# EAGLE design MySens-easyESP32-011 (EAGLE 7.7.0)
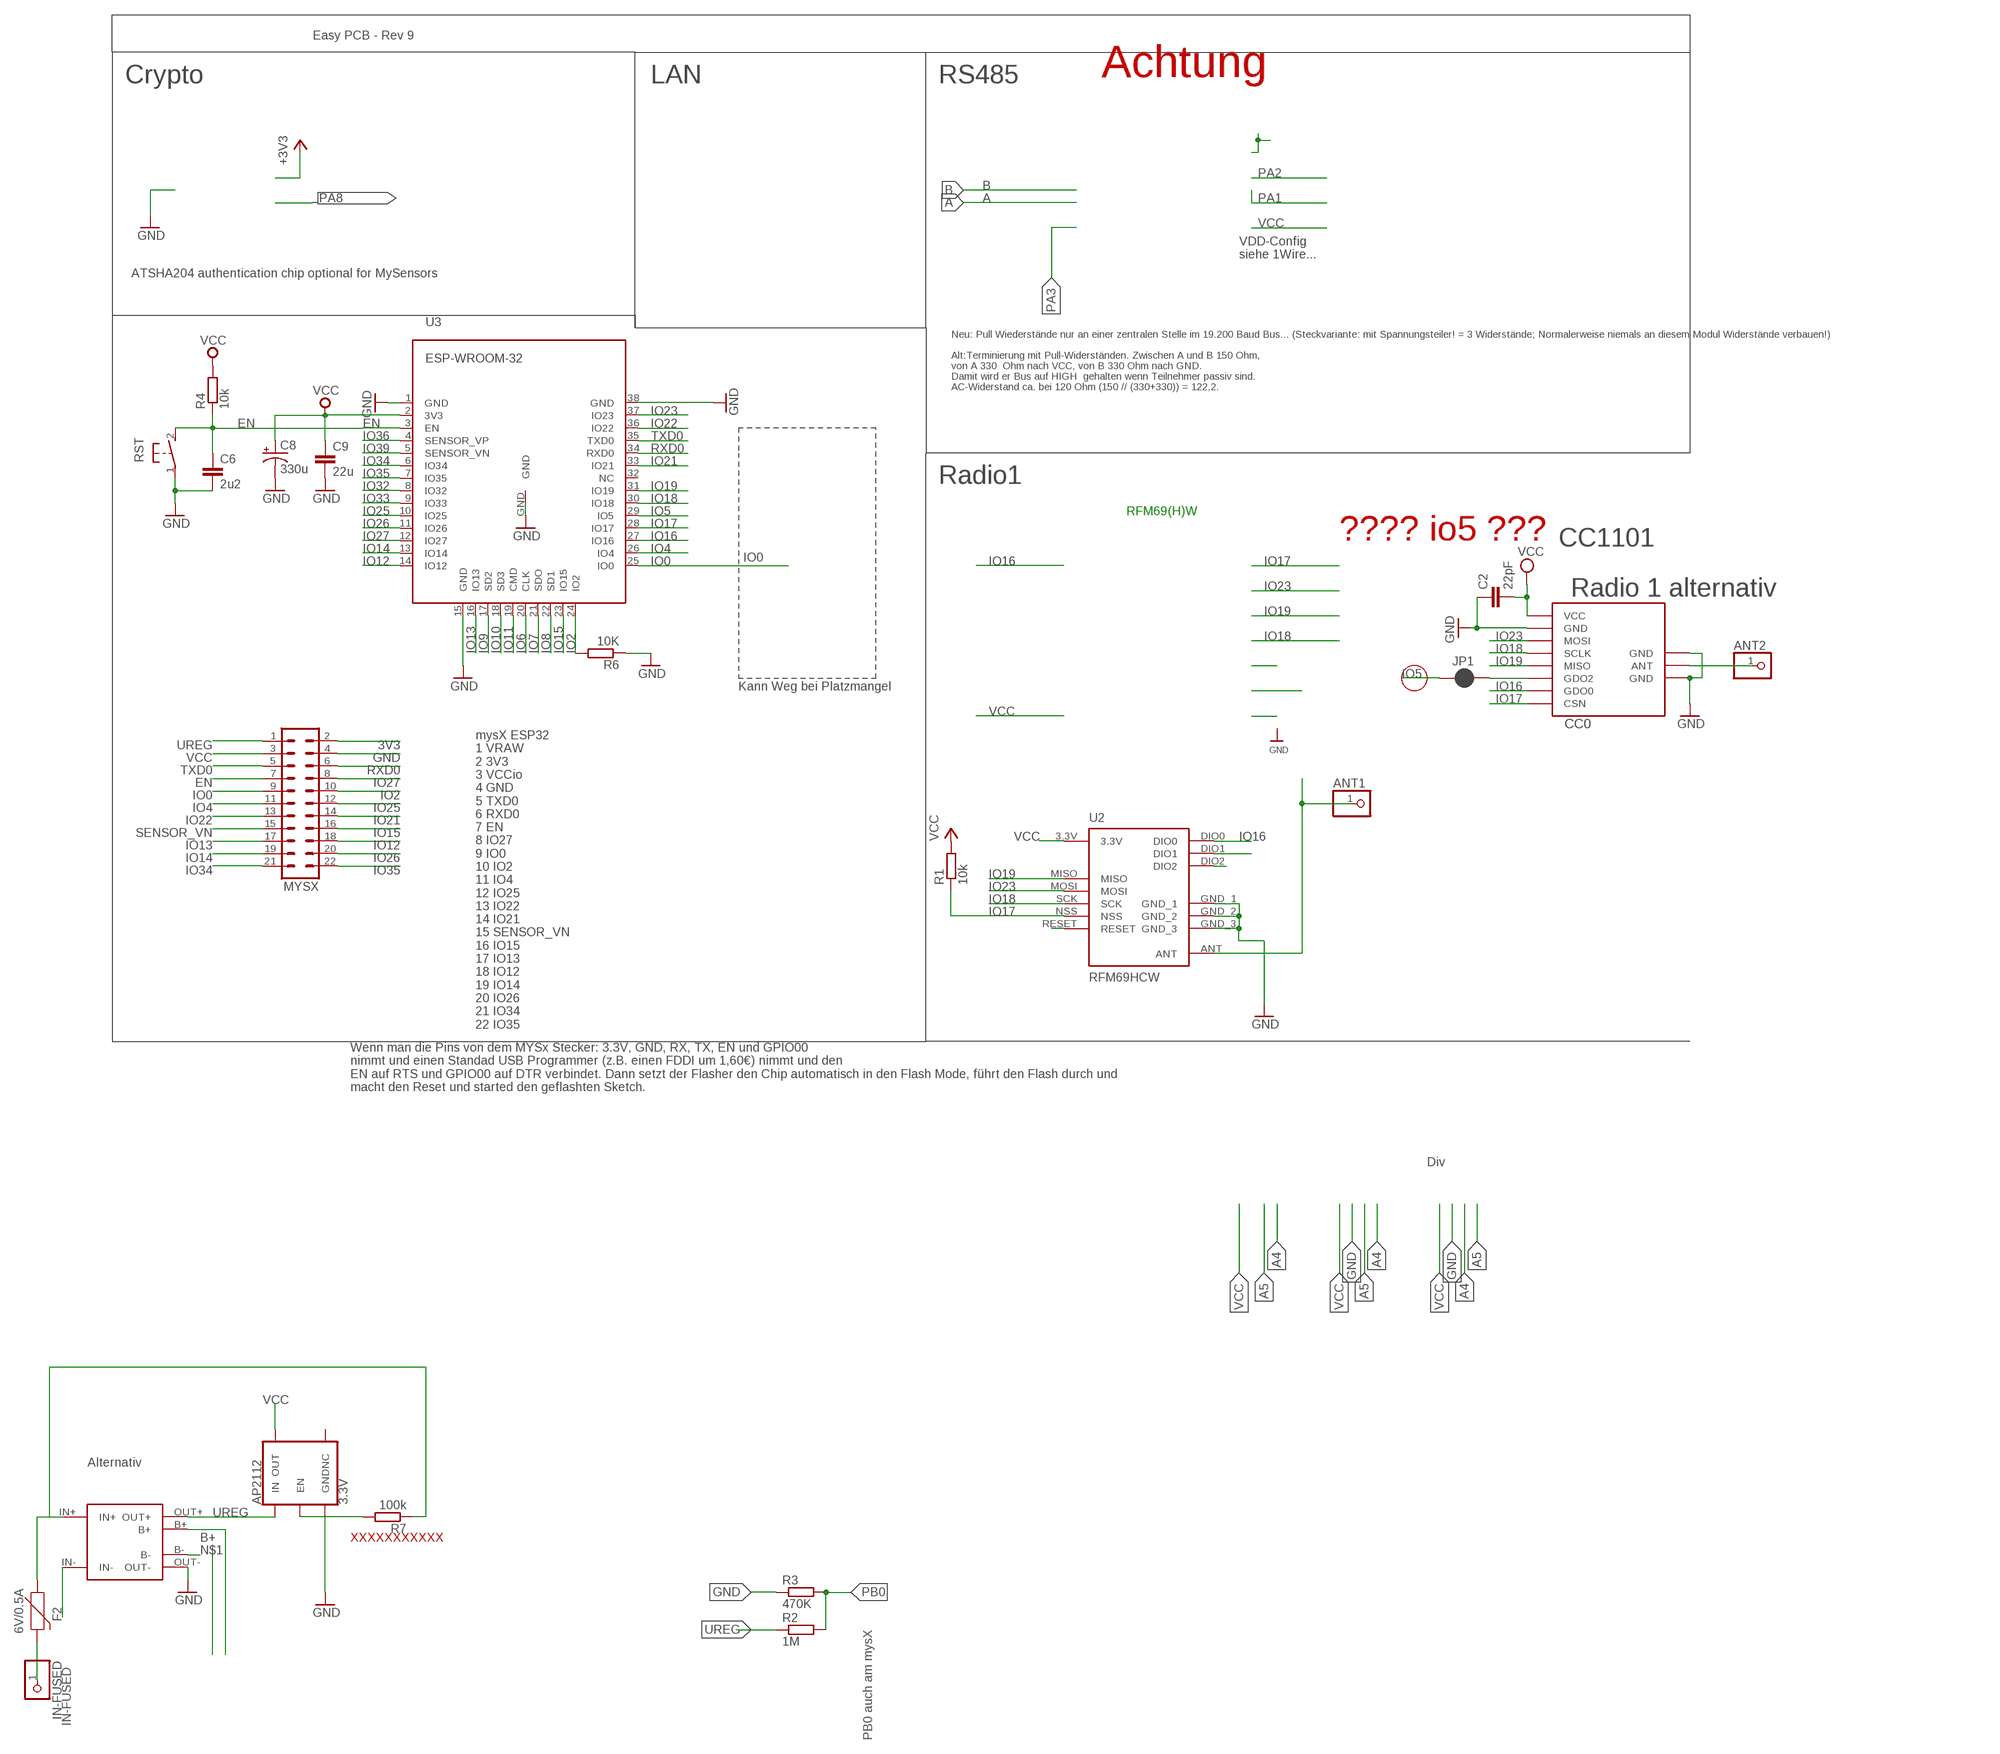
[diagram p0: schematic, sheet 1]

## Parts
ANT1  PINHD-1X1  [1X01]
ANT2  PINHD-1X1  [1X01]
AP2112  3.3V  V_REG_AP2112K-3.3V  [SOT23-5]
C2  22pF  C-EUC0805  [C0805]
C6  2u2  C-EUC0805  [C0805]
C8  330u  CAP_POLSMD  [VISHAY_C]
C9  22u  C-EUC0805  [C0805]
CC0  CC1101  CC1101_MODULE1SMD  [CC1101_MODULE1_SMD]
F2  6V/0.5A  PPTC_HALF-AMP  [1206]
IN-FUSED  PINHD-1X1  [1X01]
JP1  JUMPER-SMT_2_NC_PASTE_NO-SILK  [SMT-JUMPER_2_NC_PASTE_NO-SILK]
MYSX  MA11-2  [MA11-2]
R1  10k  R-EU_M0805  [M0805]
R2  1M  R-EU_M0805  [M0805]
R3  470K  R-EU_M0805  [M0805]
R4  10k  R-EU_M0805  [M0805]
R6  10K  R-EU_M0805  [M0805]
R7  100k  R-EU_M0805  [M0805]
RST  DTSM-3  [DTSM-3]
TP4056  TP4056-MODULE  [TP4056-LITHIUM-PROTECTED-MODULE]
U2  RFM69HCW  [RFM69HCW-XXXS2]
U3  ESP-WROOM-32  [ESP-WROOM-32]

## Nets
3V3: MYSX.2 ; supply symbol labelled +3V3
ANT0: ANT2.1 CC0.ANT
ANT1: ANT1.1 U2.ANT
B+ [vcc]: TP4056.B+
EN: C6.1 MYSX.7 R4.1 RST.2 U3.3(EN)
GND [gnd]: AP2112.2(GND) C2.1 C6.2 C8.- C9.2 CC0.GND@0(GND) CC0.GND@1(GND) CC0.GND@2(GND) MYSX.4 R3.1 R6.1 RST.1 TP4056.OUT- U2.GND_1 U2.GND_2 U2.GND_3 U3.1(GND) U3.15(GND) U3.38(GND) U3.GND
IN++ [vcc]: F2.1 R7.1 TP4056.IN+
IN- [gnd]: TP4056.IN-
IN-FUSED: F2.2 IN-FUSED.1
IO0: MYSX.9 U3.25(IO0)
IO2: MYSX.10 R6.2 U3.24(IO2)
IO4: MYSX.11 U3.26(IO4)
IO5: JP1.1 U3.29(IO5)
IO6: U3.20(CLK)
IO7: U3.21(SDO)
IO8: U3.22(SD1)
IO9: U3.17(SD2)
IO10: U3.18(SD3)
IO11: U3.19(CMD)
IO12: MYSX.18 U3.14(IO12)
IO13: MYSX.17 U3.16(IO13)
IO14: MYSX.19 U3.13(IO14)
IO15: MYSX.16 U3.23(IO15)
IO16: CC0.GDO0 U2.DIO0 U3.27(IO16)
IO17: CC0.CSN R1.1 U2.NSS U3.28(IO17)
IO18: CC0.SCLK U2.SCK U3.30(IO18)
IO19: CC0.MISO U2.MISO U3.31(IO19)
IO21: MYSX.14 U3.33(IO21)
IO22: MYSX.13 U3.36(IO22)
IO23: CC0.MOSI U2.MOSI U3.37(IO23)
IO25: MYSX.12 U3.10(IO25)
IO26: MYSX.20 U3.11(IO26)
IO27: MYSX.8 U3.12(IO27)
IO32: U3.8(IO32)
IO33: U3.9(IO33)
IO34: MYSX.21 U3.6(IO34)
IO35: MYSX.22 U3.7(IO35)
IO36: U3.4(SENSOR_VP)
IO39: U3.5(SENSOR_VN)
MAYBE_IO5: CC0.GDO2 JP1.2
N$1 [gnd]: TP4056.B-
N$4: U2.DIO2
N$8: U2.DIO1
N$9: U2.RESET
N$12: AP2112.3(EN) R7.2
PB0: R2.2 R3.2
RXD0: MYSX.6 U3.34(RXD0)
SENSOR_VN: MYSX.15
TXD0: MYSX.5 U3.35(TXD0)
UREG [gnd]: AP2112.1(IN) MYSX.1 R2.1 TP4056.OUT+
VCC [gnd]: AP2112.5(OUT) C2.2 C8.+ C9.1 CC0.VCC MYSX.3 R1.2 R4.2 U2.3.3V U3.2(3V3)
Unconnected: AP2112.4(NC) U3.32(NC)

## Notes on the sheet
- Easy PCB - Rev 9
- Crypto | LAN | RS485 | Achtung
- VDD-Config
  siehe 1Wire...
- ATSHA204 authentication chip optional for MySensors
- Neu: Pull Wiederstände nur an einer zentralen Stelle im 19.200 Baud Bus... (Steckvariante: mit Spannungsteiler! = 3 Widerstände; Normalerweise niemals an diesem Modul Widerstände verbauen!)
  
  Alt:Terminierung mit Pull-Widerständen. Zwischen A und B 150 Ohm,
  von A 330  Ohm nach VCC, von B 330 Ohm nach GND. 
  Damit wird er Bus auf HIGH  gehalten wenn Teilnehmer passiv sind.
  AC-Widerstand ca. bei 120 Ohm (150 // (330+330)) = 122,2.
- Radio1
- RFM69(H)W
- ???? io5 ??? | CC1101
- Radio 1 alternativ
- Kann Weg bei Platzmangel
- mysX ESP32
  1 VRAW
  2 3V3
  3 VCCio
  4 GND
  5 TXD0
  6 RXD0
  7 EN
  8 IO27
  9 IO0
  10 IO2
  11 IO4
  12 IO25
  13 IO22
  14 IO21
  15 SENSOR_VN
  16 IO15
  17 IO13
  18 IO12
  19 IO14
  20 IO26
  21 IO34
  22 IO35
- Wenn man die Pins von dem MYSx Stecker: 3.3V, GND, RX, TX, EN und GPIO00
  nimmt und einen Standad USB Programmer (z.B. einen FDDI um 1,60€) nimmt und den
  EN auf RTS und GPIO00 auf DTR verbindet. Dann setzt der Flasher den Chip automatisch in den Flash Mode, führt den Flash durch und
  macht den Reset und started den geflashten Sketch.
- Div
- Alternativ
- XXXXXXXXXXX
- PB0 auch am mysX

## Library data of the parts
ANT1 ANT2 IN-FUSED = pinhead:PINHD-1X1: PIN HEADER
AP2112 = SparkFun-IC-Power:V_REG_AP2112: AP2112 - 600mA CMOS LDO Regulator w/ Enable The AP2112 is CMOS process low dropout linear regulator with enable function, the regulator delivers a guaranteed 600mA (min.) continuous load current. Features Output Voltage Accuracy: ±1.5% Output Current: 600mA (Min.) Foldback Short Current Protection: 50mA Enable Function to Turn ON/OFF VOUT Low Dropout Voltage (3.3V): 250mV (Typ.) @IOUT=600mA Excellent Load Regulation: 0.2%/A (Typ.) Excellent Line Regulation: 0.02%/V (Typ.) Low Quiescent Current: 55μA (Typ.) Low Standby Current: 0.01μA (Typ.) Low Output Noise: 50μVRMS PSRR: 100Hz -65dB, 1kHz -65dB OTSD Protection Stable with 1.0μF Flexible Cap: Ceramic, Tantalum and Aluminum Electrolytic Operation Temperature Range: -40°C to 85°C ESD: MM 400V, HBM 4000V; PROD_ID: VREG-12457
C2 = rcl:C-EU: CAPACITOR, European symbol
C6 C9 = rcl@1:C-EU: CAPACITOR, European symbol; SPICEPREFIX: C
C8 = SparkFun-Passives:CAP_POL: Capacitor Polarized These are standard SMD and PTH capacitors. Normally 10uF, 47uF, and 100uF in electrolytic and tantalum varieties. Always verify the external diameter of the through hole cap, it varies with capacity, voltage, and manufacturer. The EIA devices should be standard.
CC0 = wireless:CC1101_MODULE1: CC1101 wireless module for 433/868 MHz (sold from Aliexpress). DIL version for mounting with pin header (and SMD soldering) and SMD only variant available.
F2 = SparkFun-Fuses:PPTC: Resettable Fuse PPTC Resettable Fuse. Really a sort of resistor with a polymeric positive temperature coefficient whose resistance increases dramatically with an increase in temperature. When heated by the power passing through the resistance rises causing the current to be limited, protecting the circuit. This is achieved by the transition of the polymer from a crystalline to an amorphous state where the conductive carbon separates breaking the conductive pathways found in the cool crystalline structure. When a PPTC cools back down it resumes conducting letting the circuit turn back on. SparkFun Products: SparkFun RedBoard - Programmed with Arduino <https://www.sparkfun.com/products/12757> Pro Micro - 5V/16MHz <https://www.sparkfun.com/products/12640> Arduino Pro 328 - 5V/16MHz <https://www.sparkfun.com/products/10915> MP3 Trigger <https://www.sparkfun.com/products/13720>; PROD_ID: RES-08585
JP1 = SparkFun-Jumpers:JUMPER-SMT_2_NC_PASTE: Normally closed solder jumper This jumper has an aperture in the stencil to allow solder paste to bridge the split in the wire so it's normally closed (NC). Wick off the solder to open the connection. Reapply solder to reclose the connection.
MYSX = con-Pinheader:MA11-2: PIN HEADER; OC_FARNELL: unknown; OC_NEWARK: unknown
R1-R3 R6 R7 = rcl:R-EU_: RESISTOR, European symbol
R4 = rcl@1:R-EU_: RESISTOR, European symbol; SPICEPREFIX: R
RST = switch-tact:DTSM-3
TP4056 = tp2112-usw:TP4056-MODULE
U2 = doug:RFM69H
U3 = esp32:ESP-WROOM-32

## Net classes
0 default: width 0.305 mm, clearance 0.205 mm
1 gnd: width 0.457 mm, drill 0.635 mm, clearance 0.254 mm
2 vcc: width 0.406 mm, drill 0.406 mm, clearance 0.254 mm

## Board
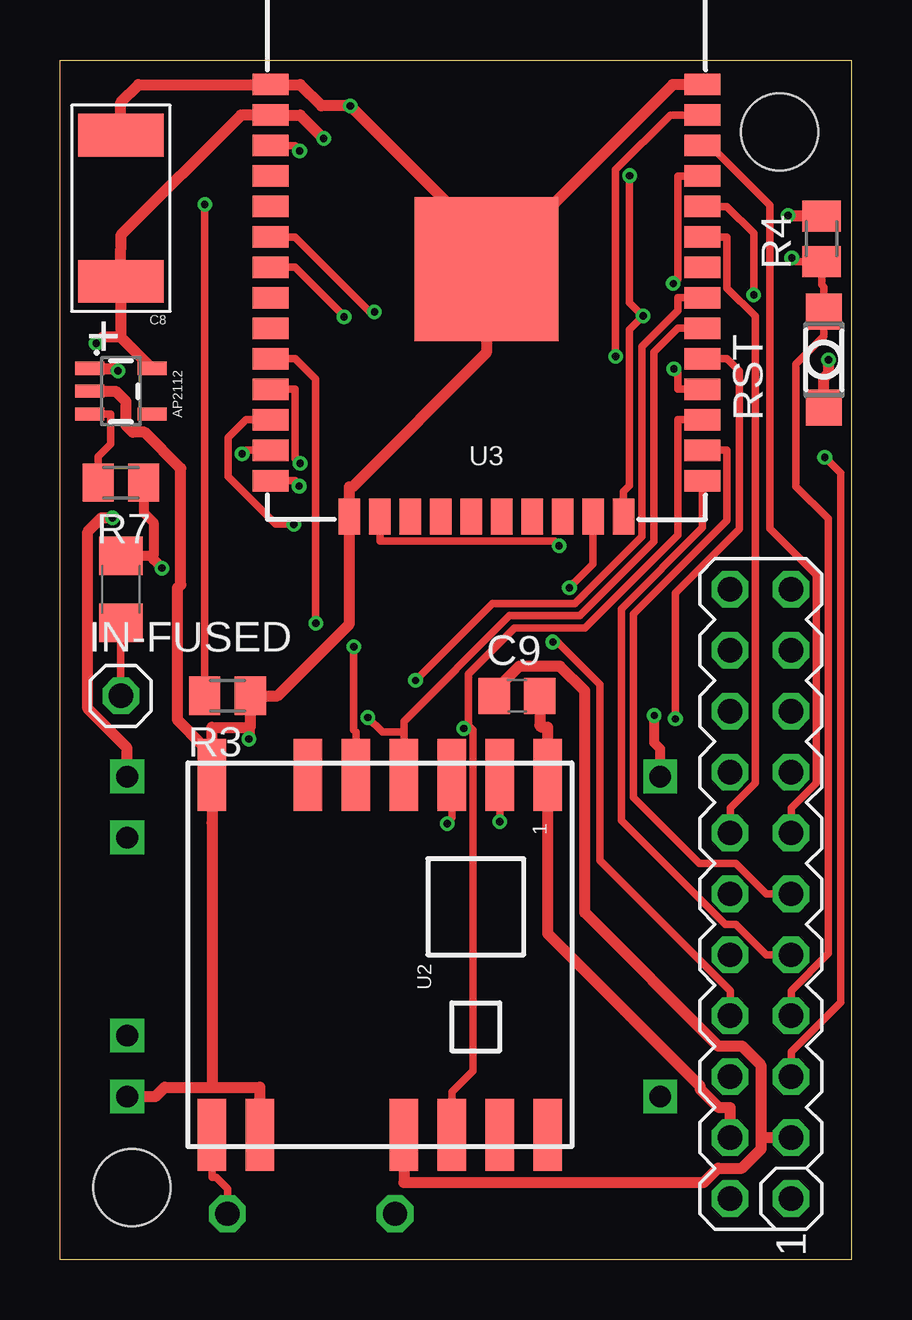
[diagram p1: board, top side]
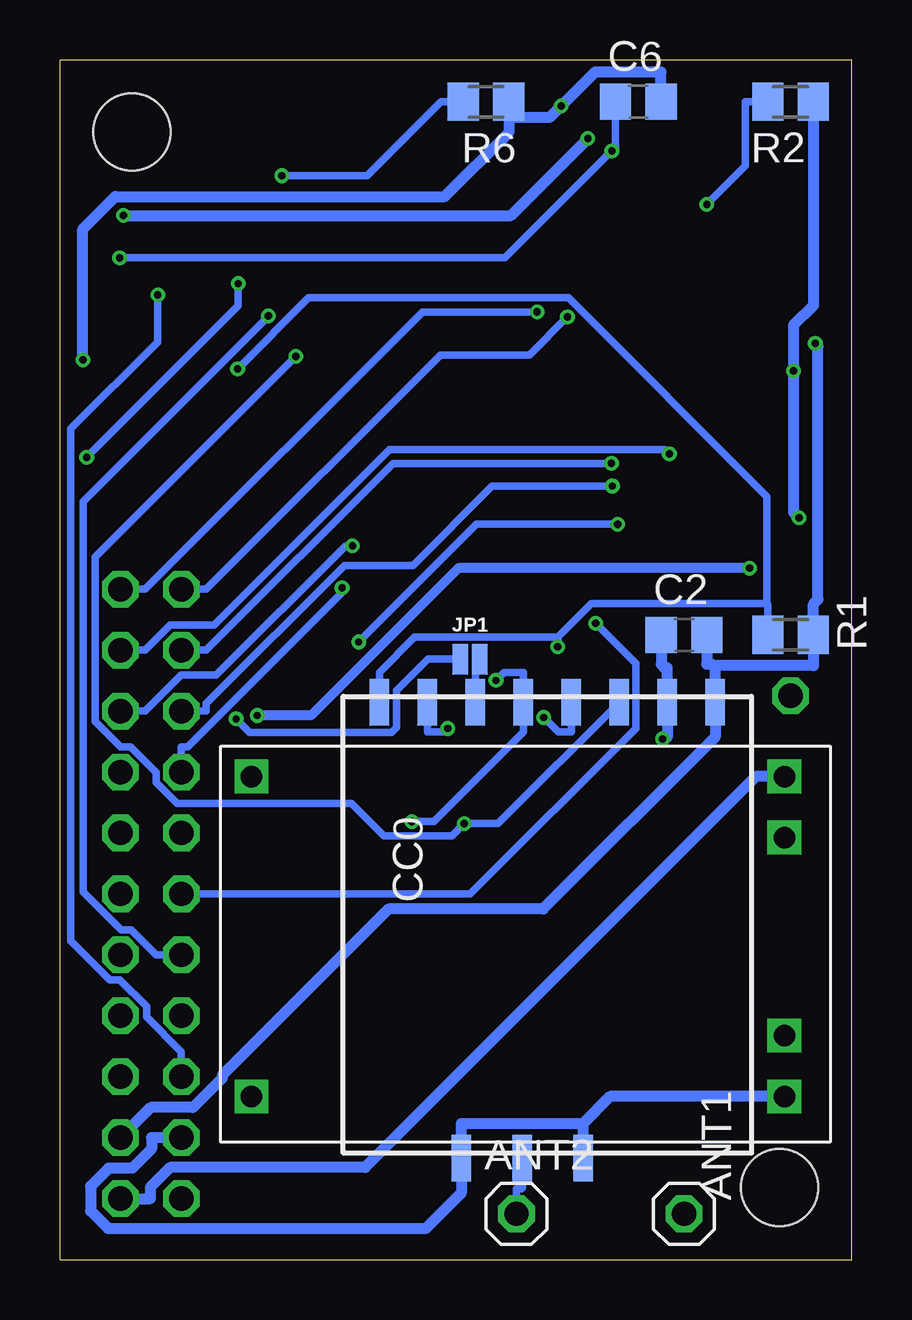
[diagram p2: board, bottom side, seen from below]

Size 33 x 50 mm. Coordinates in mm from the lower left corner, seen from the top.
Outline: 0,0 0,50 33,50 33,0 0,0
Copper layers (1*16): Top 0.035mm / dielectric 1.5mm / Bottom 0.035mm
Design rules "dirt_cheap_dirty_boards.v1": minimum track width 5mil, minimum drill 12mil, track to track 5mil, track to pad 5mil, pad to pad 5mil, via to via 5mil, smd to smd 0mil, copper to edge 10mil, drill to drill 10mil, minimum pad ring 10mil, minimum via ring 6mil, stop-mask expansion 2mil, vias tented up to drill 25mil, thermal gap 10mil
Holes 3.2 mm at 3,3 30,47

### Footprints (pad centres in the part's own frame; a part is rotated, then mirrored left to right if it is on the bottom)
1X01 = drill 1.016 octagon: 1 0,0
SOT23-5 = smd 0.55 x 1.2: 1 -0.95,-1.3; 2 0,-1.3; 3 0.95,-1.3; 4 0.95,1.3; 5 -0.95,1.3
C0805 = smd 1.3 x 1.5: 1 -0.95,0; 2 0.95,0
VISHAY_C = smd 3.556 x 1.778: + 0,3.048; - 0,-3.048
CC1101_MODULE1_SMD = smd 1.93 x 0.813: ANT 19,5.96; CSN 0,0; GDO0 0,2; GDO2 0,4; GND@0 0,12; GND@1 19,8.5; GND@2 19,3.42; MISO 0,6; MOSI 0,10; SCLK 0,8; VCC 0,14
1206 = smd 1.6 x 1.8: 1 -1.4,0; 2 1.4,0
SMT-JUMPER_2_NC_PASTE_NO-SILK = smd 0.635 x 1.27: 1 -0.406,0; 2 0.406,0
MA11-2 = drill 1.016 octagon: 1 -12.7,-1.27; 2 -12.7,1.27; 3 -10.16,-1.27; 4 -10.16,1.27; 5 -7.62,-1.27; 6 -7.62,1.27; 7 -5.08,-1.27; 8 -5.08,1.27; 9 -2.54,-1.27; 10 -2.54,1.27; 11 0,-1.27; 12 0,1.27; 13 2.54,-1.27; 14 2.54,1.27; 15 5.08,-1.27; 16 5.08,1.27; 17 7.62,-1.27; 18 7.62,1.27; 19 10.16,-1.27; 20 10.16,1.27; 21 12.7,-1.27; 22 12.7,1.27
M0805 = smd 1.3 x 1.6: 1 -0.95,0; 2 0.95,0
DTSM-3 = smd 1.5 x 1.5: 1 -2,0; 2 2,0
TP4056-LITHIUM-PROTECTED-MODULE = drill 0.9 square: B+ 10.795,4.445; B- 10.795,-3.81; IN+ -11.43,6.985; IN- -11.43,-6.35; OUT+ 10.795,6.985; OUT- 10.795,-6.35
RFM69HCW-XXXS2 = smd 3 x 1.2: 3.3V 7.5,1; ANT 7.5,-7; DIO0 7.5,3; DIO1 7.5,5; DIO2 7.5,7; GND_1 7.5,-5; GND_2 -7.5,-7; GND_3 -7.5,7; MISO -7.5,5; MOSI -7.5,3; NSS -7.5,-1; RESET -7.5,-3; SCK -7.5,1
ESP-WROOM-32 = smd 0.9 x 1.5: 1 7.7,9; 2 6.43,9; 3 5.16,9; 4 3.89,9; 5 2.62,9; 6 1.35,9; 7 0.08,9; 8 -1.19,9; 9 -2.46,9; 10 -3.73,9; 11 -5,9; 12 -6.27,9; 13 -7.54,9; 14 -8.81,9; 25 -8.81,-9; 26 -7.54,-9; 27 -6.27,-9; 28 -5,-9; 29 -3.73,-9; 30 -2.46,-9; 31 -1.19,-9; 32 0.08,-9; 33 1.35,-9; 34 2.62,-9; 35 3.89,-9; 36 5.16,-9; 37 6.43,-9; 38 7.7,-9 | smd 1.5 x 0.9: 15 -10.3,5.715; 16 -10.3,4.445; 17 -10.3,3.175; 18 -10.3,1.905; 19 -10.3,0.635; 20 -10.3,-0.635; 21 -10.3,-1.905; 22 -10.3,-3.175; 23 -10.3,-4.445; 24 -10.3,-5.715 | smd 6 x 6: GND 0,0

### Placement (x,y rotation side)
ANT1  6.99,1.91 0 bottom
ANT2  13.97,1.91 0 bottom
AP2112  2.54,36.2 270 top
C2  6.99,26.04 0 bottom
C6  8.89,48.26 0 bottom
C8  2.54,43.81 180 top
C9  19.05,23.5 0 top
CC0  19.68,23.23 270 bottom
F2  2.54,27.94 270 top
IN-FUSED  2.54,23.5 0 top
JP1  15.91,25.02 0 bottom
MYSX  29.21,15.24 90 top
R1  2.54,26.04 0 bottom
R2  2.54,48.26 180 bottom
R3  6.99,23.5 180 top
R4  31.75,42.55 90 top
R6  15.24,48.26 180 bottom
R7  2.54,32.38 180 top
RST  31.84,37.51 90 top
TP4056  13.6,13.14 0 bottom
U2  13.34,12.7 270 top
U3  17.78,41.27 90 top

### Tracks (layer width: path | path; a pad name or v marks a point on that pad's centre or on a via)
ANT0
  Bottom 0.305: ANT2.1 13.97,2.95 13.76,2.95 13.72,2.98 CC0.ANT
ANT1
  Top 0.305: U2.ANT 6.33,3.42 6.51,3.42 6.99,2.95 ANT1.1
EN  (via drill 0.3 pad 0.61)
  Top 0.305: MYSX.7 30.48,11.2 32.03,12.75 32.03,30.88 30.69,32.22 30.69,37.32 31.84,38.48 RST.2 31.84,40.02 31.84,40.54 31.75,40.63 R4.1 30.67,41.59 v30.51,41.75 | U3.3 9.81,46.44 9.81,46.39 v9.99,46.22
  Bottom 0.305: v30.51,41.75 14.45,41.75 v9.99,46.22 9.84,46.36 C6.1
GND  (via drill 0.3 pad 0.61)
  Top 0.457: C9.2 20,22.26 20.08,22.18 20.34,22.18 U2.GND_3 20.34,13.58 26.7,7.22 26.7,7.1 27.47,6.33 27.94,6.33 MYSX.4 | U2.GND_1 8.34,7.18 | TP4056.OUT- 3.99,6.79 4.37,7.18 6.33,7.18 | 6.33,7.18 8.34,7.18 | 8.34,7.18 | 6.33,7.18 6.33,18.22 U2.GND_2 6.33,21.19 6.33,21.44 | 6.33,21.44 5.96,21.44 4.9,22.49 4.9,28 5.04,28.13 5.04,32.98 3.52,34.49 3.03,34.49 2.75,34.77 2.75,35.76 2.32,36.2 AP2112.2 | v32.04,37.5 32.04,36.94 31.84,36.74 RST.1 | 18.2,41.27 18.2,41.98 v12.1,48.09 10.9,48.09 10.01,48.98 U3.1 3.28,48.98 2.54,48.23 C8.- | 18.2,41.27 19.52,41.27 19.52,42.95 25.55,48.98 U3.38 | 18.2,41.27 U3.GND 17.78,37.79 12.2,32.21 12.06,32.21 U3.15 12.06,26.49 9.07,23.5 R3.1 7.93,22.21 7.91,22.18 7.88,22.18 | 6.33,21.44 6.33,21.69 6.33,22.18 7.88,22.18 | 7.88,22.18 v7.88,21.7
  Bottom 0.457: v32.04,37.5 32.04,42.95 30.69,44.3 16.96,44.3 14.29,46.98 14.29,47.62 | 14.29,47.62 12.57,47.62 v12.1,48.09 10.69,49.49 7.94,49.49 C6.2 | R6.1 14.29,47.62 | C2.1 7.93,24.8 7.8,24.67 7.68,24.67 CC0.GND@0 7.68,22.5 7.68,21.78 7.8,21.78 v7.88,21.7 | MYSX.4 29.18,5.08 29.18,4.61 29.99,3.81 30.98,3.81 31.73,3.06 31.73,2.02 31,1.29 17.75,1.29 16.27,2.78 CC0.GND@2 16.27,5.67 11.19,5.67 | CC0.GND@1 11.19,5.67 | TP4056.OUT- 10.06,6.79 11.19,5.67
IN++  (via drill 0.3 pad 0.61)
  Top 0.406: R7.1 3.49,31.13 3.9,30.72 3.9,29.34 | TP4056.IN+ 25.02,21.29 24.78,21.54 v24.78,22.68 | F2.1 3.9,29.34 | v4.25,28.82 3.9,29.17 3.9,29.34
  Bottom 0.406: v4.25,28.82 16.39,28.82 22.53,22.68 v24.78,22.68
IN-FUSED
  Top 0.305: IN-FUSED.1 F2.2
IO0
  Top 0.305: MYSX.9 29.44,12.7 28.17,13.97 27.74,13.97 23.4,18.3 23.4,27.12 26.78,30.5 U3.25
IO2  (via drill 0.3 pad 0.61)
  Top 0.305: v23.75,45.18 23.75,39.89 v24.31,39.33 23.75,38.77 23.75,32.26 23.5,32 U3.24
  Bottom 0.305: v24.31,39.33 32.03,31.6 32.03,15.32 30.45,13.74 30.02,13.74 28.98,12.7 MYSX.10 | R6.2 17.12,48.26 20.2,45.18 v23.75,45.18
IO4
  Top 0.305: MYSX.11 29.44,15.24 28.17,16.51 26.66,16.51 23.91,19.25 23.91,26.91 27.81,30.81 27.81,33.73 U3.26
IO5  (via drill 0.3 pad 0.61)
  Top 0.305: v25.65,22.54 25.65,27.79 28.32,30.45 28.32,37.03 27.81,37.55 U3.29
  Bottom 0.305: v25.65,22.54 25.08,21.96 19.18,21.96 18.96,22.18 18.96,23.71 17.65,25.02 JP1.1
IO12  (via drill 0.3 pad 0.61)
  Top 0.305: v9.97,32.24 9.81,32.4 9.81,32.47 U3.14
  Bottom 0.305: v9.97,32.24 14.98,32.24 18.29,28.93 21.13,28.93 26.9,23.17 26.9,22.86 MYSX.18
IO13  (via drill 0.3 pad 0.61)
  Top 0.305: v20.81,29.75 20.61,29.95 13.34,29.95 U3.16
  Bottom 0.305: v20.81,29.75 21.1,29.75 26.48,24.36 27.94,24.36 29.44,22.86 MYSX.17
IO14  (via drill 0.3 pad 0.61)
  Top 0.305: v7.6,33.59 7.75,33.73 U3.13
  Bottom 0.305: v7.6,33.59 7.78,33.77 19.25,33.77 26.58,26.44 28.4,26.44 29.44,25.4 MYSX.19
IO15  (via drill 0.3 pad 0.61)
  Top 0.305: U3.23 22.23,28.99 v21.24,28
  Bottom 0.305: v21.24,28 21.24,27.8 27.68,21.36 27.94,21.36 MYSX.16
IO16  (via drill 0.3 pad 0.61)
  Top 0.305: 17.04,22.25 17.04,24.42 18.95,26.32 21.88,26.32 25.75,30.19 25.75,35.01 U3.27 | 17.04,22.25 16.95,22.25 v16.83,22.14 | 17.04,22.25 17.21,22.08 17.21,7.86 16.34,6.98 U2.DIO0
  Bottom 0.305: v16.83,22.14 16.99,21.98 17.68,21.98 CC0.GDO0
IO17  (via drill 0.3 pad 0.61)
  Top 0.305: U3.28 25.75,36.27 25.75,36.97 v25.59,37.12 | v12.25,25.54 12.25,22.07 12.34,21.98 U2.NSS
  Bottom 0.305: 3.53,27.34 3.53,31.81 11.81,40.08 22.63,40.08 v25.59,37.12 | 3.53,27.34 10.84,27.34 12.25,25.94 | 3.53,27.34 3.49,27.3 3.49,27.02 R1.1 | 12.25,25.94 v12.25,25.54 | 12.25,25.94 18.21,25.94 19.68,24.47 CC0.CSN
IO18  (via drill 0.3 pad 0.61)
  Top 0.305: 14.34,21.98 14.34,22.44 18.73,26.83 21.67,26.83 24.77,29.93 24.77,37.83 25.75,38.81 U3.30 | 14.34,21.98 13.45,21.98 v12.83,22.59 | U2.SCK 14.34,21.98
  Bottom 0.305: v12.83,22.59 12.22,21.98 11.69,21.98 CC0.SCLK
IO19  (via drill 0.3 pad 0.61)
  Top 0.305: v14.82,24.14 18.03,27.34 21.46,27.34 24.26,30.14 24.26,38.05 25.75,39.54 25.75,40.09 U3.31 | v18.34,18.25 18.34,18.42 U2.MISO
  Bottom 0.305: v18.34,18.25 17.41,18.25 13.69,21.98 CC0.MISO 13.69,24.47 14.49,24.47 v14.82,24.14
IO21
  Top 0.305: MYSX.14 27.94,18.82 28.98,19.86 28.98,39.33 27.81,40.5 27.81,42.62 U3.33
IO22
  Top 0.305: U3.36 27.11,46.44 29.58,43.96 29.58,30.47 31.52,28.53 31.52,19.86 30.48,18.82 MYSX.13
IO23  (via drill 0.3 pad 0.61)
  Top 0.305: v23.16,37.65 23.16,45.42 25.45,47.7 25.75,47.7 U3.37 | U2.MOSI 16.34,18.42 16.15,18.24 v16.15,18.17
  Bottom 0.305: v23.16,37.65 31.52,29.29 31.52,22.42 30.46,21.36 30.05,21.36 28.98,20.3 28.98,19.89 28.11,19.02 20.84,19.02 19.49,17.66 16.66,17.66 v16.15,18.17 14.74,18.17 CC0.MOSI
IO25  (via drill 0.3 pad 0.61)
  Top 0.305: U3.10 9.81,37.55 10.66,36.69 v10.66,26.52
  Bottom 0.305: v10.66,26.52 8.99,24.85 8.99,22.14 15.9,15.24 26.9,15.24 MYSX.12
IO26  (via drill 0.3 pad 0.61)
  Top 0.305: U3.11 9.81,36.27 9.81,33.38 v10.01,33.18
  Bottom 0.305: v10.01,33.18 19.12,33.18 26.9,25.4 MYSX.20
IO27  (via drill 0.3 pad 0.61)
  Top 0.305: U3.12 7.75,35.01 7.01,34.26 7.01,32.64 9,30.65 v9.75,30.65 | MYSX.8 27.94,11.2 22.51,16.63 22.51,23.97 20.74,25.74 v20.55,25.74 | v9.75,30.65
  Bottom 0.305: v9.75,30.65 15.64,30.65 v20.55,25.74
IO34  (via drill 0.3 pad 0.61)
  Top 0.305: v13.11,39.5 12.94,39.5 9.81,42.62 U3.6 | v13.11,39.5
  Bottom 0.305: v13.11,39.5 17.88,39.5 29.44,27.94 MYSX.21
IO35  (via drill 0.3 pad 0.61)
  Top 0.305: v11.85,39.29 11.85,39.32 9.81,41.35 U3.7
  Bottom 0.305: v11.85,39.29 13.43,37.7 17.13,37.7 26.9,27.94 MYSX.22
MAYBE_IO5
  Bottom 0.305: CC0.GDO2 15.69,24.47 15.5,24.65 JP1.2
N$12
  Top 0.305: AP2112.3 2.12,35.24 2.12,33.99 1.59,33.46 R7.2
PB0  (via drill 0.3 pad 0.61)
  Top 0.305: v6.04,43.98 6.04,24.57 R3.2
  Bottom 0.305: v6.04,43.98 4.42,45.6 4.42,48.26 R2.2
RXD0  (via drill 0.3 pad 0.61)
  Top 0.305: U3.34 27.81,43.9 28.92,42.78 v28.92,40.21
  Bottom 0.305: MYSX.6 27.94,8.66 29.39,10.11 29.39,10.54 30.5,11.66 30.92,11.66 32.54,13.29 32.54,34.63 28.92,38.25 v28.92,40.21
TXD0  (via drill 0.3 pad 0.61)
  Top 0.305: v31.89,33.44 32.54,32.79 32.54,10.72 30.48,8.66 MYSX.5 | v25.57,40.68 25.75,40.86 25.75,45.16 U3.35
  Bottom 0.305: v25.57,40.68 25.57,39.76 v31.89,33.44
UREG  (via drill 0.3 pad 0.61)
  Top 0.457: TP4056.OUT+ 2.8,21.32 1.16,22.96 1.16,30.34 1.74,30.92 v2.19,30.92 | v2.42,37.05 2.32,37.15 AP2112.1
  Bottom 0.457: R2.1 1.59,39.77 2.42,38.94 v2.42,37.05 2.42,31.15 v2.19,30.92 | MYSX.1 29.23,2.54 29.23,3.01 28.41,3.83 20.28,3.83 3.99,20.13 TP4056.OUT+
VCC  (via drill 0.3 pad 0.61)
  Top 0.457: 2.54,38.45 1.77,38.45 v1.51,38.18 | v10.99,46.73 10.01,47.7 U3.2 8.16,47.7 7.55,47.7 2.54,42.7 2.54,42.14 C8.+ 2.54,40.42 2.54,38.45 | 29.23,5.08 29.23,8.09 28.44,8.89 27.45,8.89 21.88,14.46 21.88,23.7 20.85,24.73 19.14,24.73 18.1,23.68 C9.1 | 29.23,5.08 29.41,5.08 MYSX.3 | R4.2 30.47,43.49 30.45,43.52 v30.36,43.52 | 2.54,38.45 AP2112.5 | U2.3.3V 14.34,3.22 26.84,3.22 27.43,3.81 28.43,3.81 29.23,4.61 29.23,5.08
  Bottom 0.457: MYSX.3 29.22,6.34 27.45,6.34 26.24,7.56 26.24,7.67 19.31,14.61 12.86,14.61 5.68,21.78 CC0.VCC 5.68,23.41 5.68,24.67 | v1.51,38.18 1.4,38.07 1.4,27.51 1.59,27.32 1.59,26.13 R1.2 1.59,24.75 5.61,24.75 5.68,24.67 | v30.36,43.52 14.2,43.52 v10.99,46.73 | 5.68,24.67 5.82,24.8 6.04,24.8 C2.2

### Text on the board
tNames: easyGW BluePill 0.2 / RS485, RFM69, RFM95 | VCC | GND | SDL | SDA | 5V | UREG | GND | 5V
bNames: PluepillGW V01 / RS485, RFM69, RFM95
Document: DS_1551K